# Altium schematic sheet Pass Transistors.SchDoc
size 406 x 304 mm; SheetNumber: 2; SheetTotal: 4
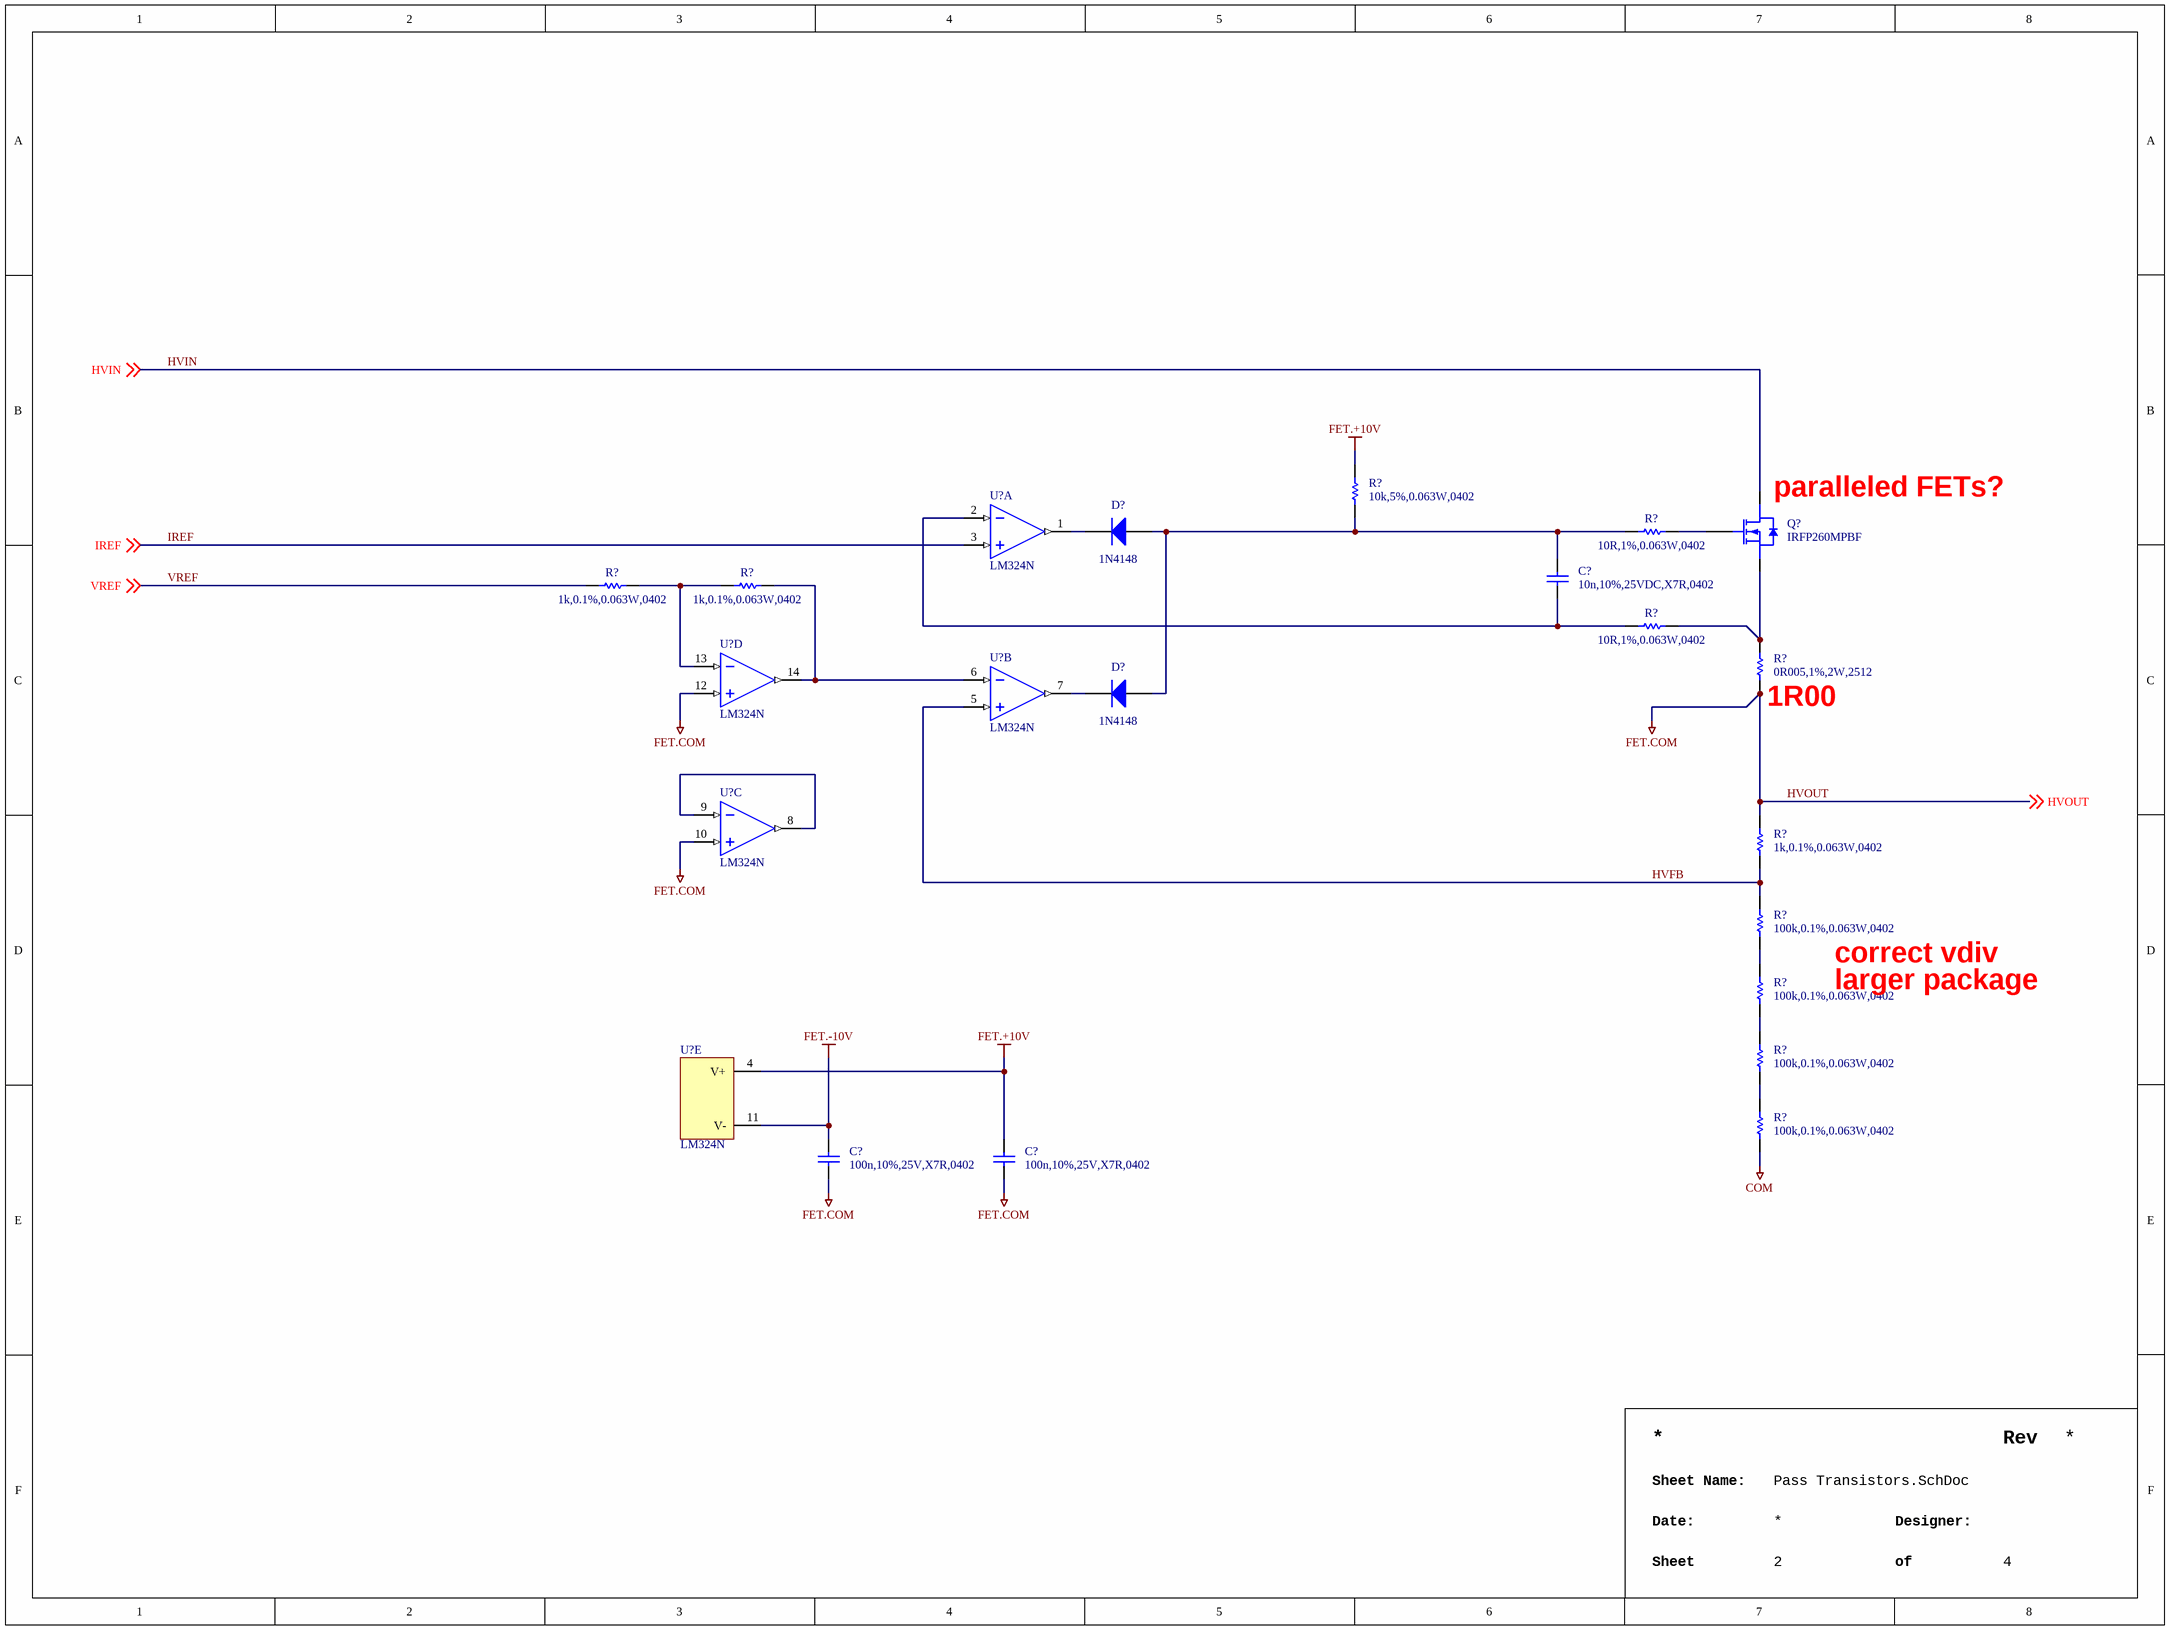
[diagram p0: Pass Transistors.SchDoc]

## Parts
(Parts that share a designator on the sheet are numbered #1, #2 ... from top to bottom, then left to right.)
C?#1  10n,10%,25VDC,X7R,0402  [CAPC1005X06N]
C?#2  100n,10%,25V,X7R,0402  [CAPC1005X06N]
C?#3  100n,10%,25V,X7R,0402  [CAPC1005X06N]
D?#1  1N4148  [ONSEMI_DO-35]
D?#2  1N4148  [ONSEMI_DO-35]
Q?  IRFP260MPBF  [INFINEON_PKG_TO247AD]
R?#1  10k,5%,0.063W,0402  [RESC1005X04N]
R?#2  10R,1%,0.063W,0402  [RESC1005X04N]
R?#3  1k,0.1%,0.063W,0402  [RESC1005X04N]
R?#4  1k,0.1%,0.063W,0402  [RESC1005X04N]
R?#5  10R,1%,0.063W,0402  [RESC1005X04N]
R?#6  0R005,1%,2W,2512  [OHMITE_PKG_MCS3264]
R?#7  1k,0.1%,0.063W,0402  [RESC1005X04N]
R?#8  100k,0.1%,0.063W,0402  [RESC1005X04N]
R?#9  100k,0.1%,0.063W,0402  [RESC1005X04N]
R?#10  100k,0.1%,0.063W,0402  [RESC1005X04N]
R?#11  100k,0.1%,0.063W,0402  [RESC1005X04N]
U?#1  LM324N  [TI_J0014A]  (part A of 5)
U?#2  LM324N  [TI_J0014A]  (part D of 5)
U?#3  LM324N  [TI_J0014A]  (part B of 5)
U?#4  LM324N  [TI_J0014A]  (part C of 5)
U?#5  LM324N  [TI_J0014A]  (part E of 5)

## Nets
COM: R?#11.1
FET.+10V: C?#3.2 R?#1.2 U?#5.4(V+)
FET.-10V: C?#2.2 U?#5.11(V-)
HVOUT: C?#2.1 C?#3.1 R?#6.1 R?#7.2 U?#2.12(IN4+) U?#4.10(IN3+) ; off-sheet HVOUT  [also labelled FET.COM]
HVFB: R?#7.1 R?#8.2 U?#3.5(IN2+)
HVIN: Q?.2(D) ; off-sheet HVIN
IREF: U?#1.3(IN1+) ; off-sheet IREF
VREF: R?#3.2 ; off-sheet VREF
NetC?#1_1: C?#1.1 R?#5.1 U?#1.2(IN1-)
NetC?#1_2: C?#1.2 D?#1.2(A) D?#2.2(A) R?#1.1 R?#2.1
NetD?#1_1: D?#1.1(K) U?#1.1(OUT1)
NetD?#2_1: D?#2.1(K) U?#3.7(OUT2)
NetQ?_1: Q?.1(G) R?#2.2
NetQ?_3: Q?.3(S) R?#5.2 R?#6.2
NetR?#3_1: R?#3.1 R?#4.2 U?#2.13(IN4-)
NetR?#4_1: R?#4.1 U?#2.14(OUT4) U?#3.6(IN2-)
NetR?#8_1: R?#8.1 R?#9.2
NetR?#9_1: R?#9.1 R?#10.2
NetR?#10_1: R?#10.1 R?#11.2
NetU?#4_8: U?#4.8(OUT3) U?#4.9(IN3-)

## Notes on the sheet
- (near Q?) paralleled FETs?
- (near R?#6) 1R00
- correct vdiv
- larger package
- Rev
- Sheet Name:
- Date:
- Sheet
- Designer:
- of

## Library data of the parts
C?#1 = CAP,Cer,10nF,10%,25VDC,X7R,0402: 10000pF ï¿½10% 25V Ceramic Capacitor X7R 0402 (1005 Metric); Manufacturer 1: Murata Electronics; Manufacturer 1 Part Number: GCM155R71E103KA37D; Vendor 1 Part Number: 490-6043-1-ND; Vendor 1: Digikey; Part Name: CAP,Cer,10nF,10%,25VDC,X7R,0402; CreatedBy: Judd Foster; HelpURL: https://psearch.en.murata.com/capacitor/product/GCM155R71E103KA37%23.pdf; Value: 10n,10%,25VDC,X7R,0402
C?#2 C?#3 = CAP,Cer,100nF,10%,25V,X7R,0402: 0.1ï¿½F ï¿½10% 25V Ceramic Capacitor X7R 0402 (1005 Metric); Manufacturer 1: Murata Electronics; Manufacturer 1 Part Number: GRM155R71E104KE14J; Vendor 1 Part Number: 490-14603-1-ND; Vendor 1: DigiKey; Value: 100nF; Part Name: CAP,Cer,100nF,10%,25V,X7R,0402; CreatedBy: Judd Foster; HelpURL: https://search.murata.co.jp/Ceramy/image/img/A01X/G101/ENG/GRM155R71E104KE14-01.pdf
D?#1 D?#2 = DIODE,Gen,100V,200mA,Axial,Thru: Diode 100 V 200mA Through Hole DO-35; Manufacturer 1: ON Semiconductor; Vendor 1 Part Number: 1N4148FS-ND; Vendor 1: Digikey; Part Name: DIODE,Gen,100V,200mA,Axial,Thru; CreatedBy: Judd Foster; HelpURL: https://www.onsemi.com/download/data-sheet/pdf/1n914-d.pdf; Manufacturer 1 Part Number: 1N4148
Q? = MOSFET,N Ch,200V,50A,IRFP260MPBF: N-Channel 200 V 50A (Tc) 300W (Tc) Through Hole TO-247AC; Manufacturer 1: Infineon Technologies; Vendor 1 Part Number: IRFP260MPBF-ND; Vendor 1: DigiKey; Part Name: MOSFET,N Ch,200V,50A,IRFP260MPBF; CreatedBy: Judd Foster; HelpURL: https://www.infineon.com/dgdl/irfp260mpbf.pdf?fileId=5546d462533600a40153562894e91fe0; Manufacturer 1 Part Number: IRFP260MPBF
R?#1 = RES,10k,5%,0.063W,0402: 10 kOhms ï¿½5% 0.063W, 1/16W Chip Resistor 0402 (1005 Metric) Automotive AEC-Q200 Thick Film; Manufacturer 1: Stackpole Electronics Inc; Manufacturer 1 Part Number: RMCF0402JT10K0; Vendor 1 Part Number: RMCF0402JT10K0CT-ND; Vendor 1: DIgikey; Part Name: RES,10k,5%,0.063W,0402; CreatedBy: Judd Foster; HelpURL: https://www.seielect.com/catalog/sei-rmcf_rmcp.pdf; Value: 10k
R?#2 R?#5 = RES,10R,1%,0.063W,0402: 10 Ohms ï¿½1% 0.063W, 1/16W Chip Resistor 0402 (1005 Metric) Automotive AEC-Q200 Thick Film; Manufacturer 1: Panasonic Electronic Components; Manufacturer 1 Part Number: ERJ-2RKF10R0X; Vendor 1 Part Number: P10.0LCT-ND; Vendor 1: Digikey; Part Name: RES,10R,1%,0.063W,0402; CreatedBy: Judd Foster; HelpURL: https://industrial.panasonic.com/cdbs/www-data/pdf/RDA0000/AOA0000C304.pdf; Value: 10R
R?#3 R?#4 R?#7 = RES,1k,0.1%,0.063W,0402: 1 kOhms Â±0.1% 0.063W, 1/16W Chip Resistor 0402 (1005 Metric) Thin Film; Manufacturer 1: YAGEO; Manufacturer 1 Part Number: RT0402BRE071KL; Vendor 1 Part Number: YAG2306CT-ND; Vendor 1: DigiKey; Part Name: RES,1k,0.1%,0.063W,0402; CreatedBy: Judd Foster; HelpURL: https://www.yageo.com/upload/media/product/app/datasheet/rchip/pyu-rt_1-to-0.01_rohs_l.pdf; Value: 1k
R?#6 = RES,0R005,1%,2W,2512: 5 mOhms Â±1% 2W Chip Resistor 2512 (6432 Metric) Current Sense, Flame Retardant Coating, Safety Metal Element; Manufacturer 1: Ohmite; Manufacturer 1 Part Number: MCS3264R005FER; Vendor 1 Part Number: MCS3264R005FERCT-ND; Vendor 1: DigiKey; Value: 5m; Part Name: RES,0R005,1%,2W,2512; CreatedBy: Judd Foster; HelpURL: https://www.ohmite.com/assets/images/res-mcs.pdf
R?#8-R?#11 = RES,100k,0.1%,0.063W,0402: 100 kOhms ï¿½0.1% 0.063W, 1/16W Chip Resistor 0402 (1005 Metric) Thin Film; Manufacturer 1: YAGEO; Manufacturer 1 Part Number: RT0402BRE07100KL; Vendor 1 Part Number: YAG2304CT-ND; Vendor 1: Digikey; Part Name: RES,100k,0.1%,0.063W,0402; CreatedBy: Judd Foster; HelpURL: https://www.yageo.com/upload/media/product/app/datasheet/rchip/pyu-rt_1-to-0.01_rohs_l.pdf; Value: 100k
U?#1-U?#5 = LM324N: General Purpose Amplifier 4 Circuit 14-PDIP; Manufacturer 1: Texas Instruments; Vendor 1 Part Number: 296-1391-5-ND; Vendor 1: Digikey; Part Name: LM324N; CreatedBy: Judd Foster; HelpURL: https://www.ti.com/lit/ds/symlink/lm224.pdf?HQS=dis-dk-null-digikeymode-dsf-pf-null-wwe&ts=1715317448370; Manufacturer 1 Part Number: LM324N